# EAGLE design rimocon (EAGLE 9.6.2)
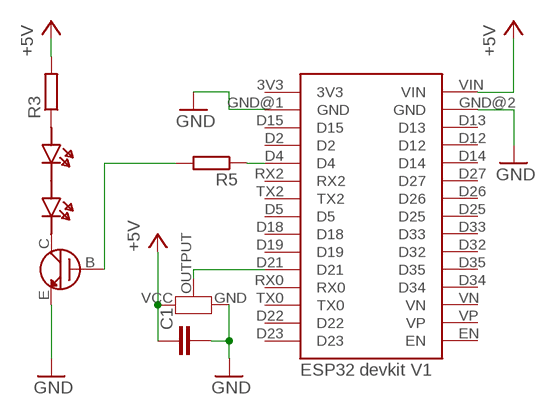
[diagram p0: schematic, sheet 1]

## Parts
C1  C-EU025-024X044  [C025-024X044]
R3  R-EU_0204/5  [0204/5]
R5  R-EU_0204/5  [0204/5]
U$1  2SC1815  [1815]
U$2  OSRB38C9AA  [OSRB38]
U$3  ESP32DEVKITV1  [ESP32DEVKITV1]
U$5  LEDOSI5FU3A11C  [OSI5FU3A11C]
U$6  LEDOSI5FU3A11C  [OSI5FU3A11C]

## Nets
+5V: C1.1 R3.2 U$2.VCC U$3.VIN
GND: C1.2 U$1.E U$2.GND U$3.GND@1(GND) U$3.GND@2(GND)
N$1: U$1.C U$5.K(CATHODE)
N$2: R3.1 U$6.A(ANODE)
N$3: R5.1 U$3.D4
N$4: U$2.OUTPUT U$3.D21
N$6: R5.2 U$1.B
N$8: U$5.A(ANODE) U$6.K(CATHODE)
Unconnected: U$3.D2 U$3.D5 U$3.D12 U$3.D13 U$3.D14 U$3.D15 U$3.D18 U$3.D19 U$3.D22 U$3.D23 U$3.D25 U$3.D26 U$3.D27 U$3.D32 U$3.D33 U$3.D34 U$3.D35 U$3.EN U$3.RX0 U$3.RX2 U$3.TX0 U$3.TX2 U$3.VN U$3.VP

## Power pins joined to a net without a drawn wire
3V3: U$3.3V3

## Library data of the parts
C1 = my_rcl:C-EU: CAPACITOR, European symbol
R3 R5 = my_rcl:R-EU_: RESISTOR, European symbol
U$1 = Custom_Parts:2SC1815
U$2 = Custom_Parts:OSRB38C9AA
U$3 = Custom_IC:ESP32DEVKITV1
U$5 U$6 = Custom_Parts:LED

## Board
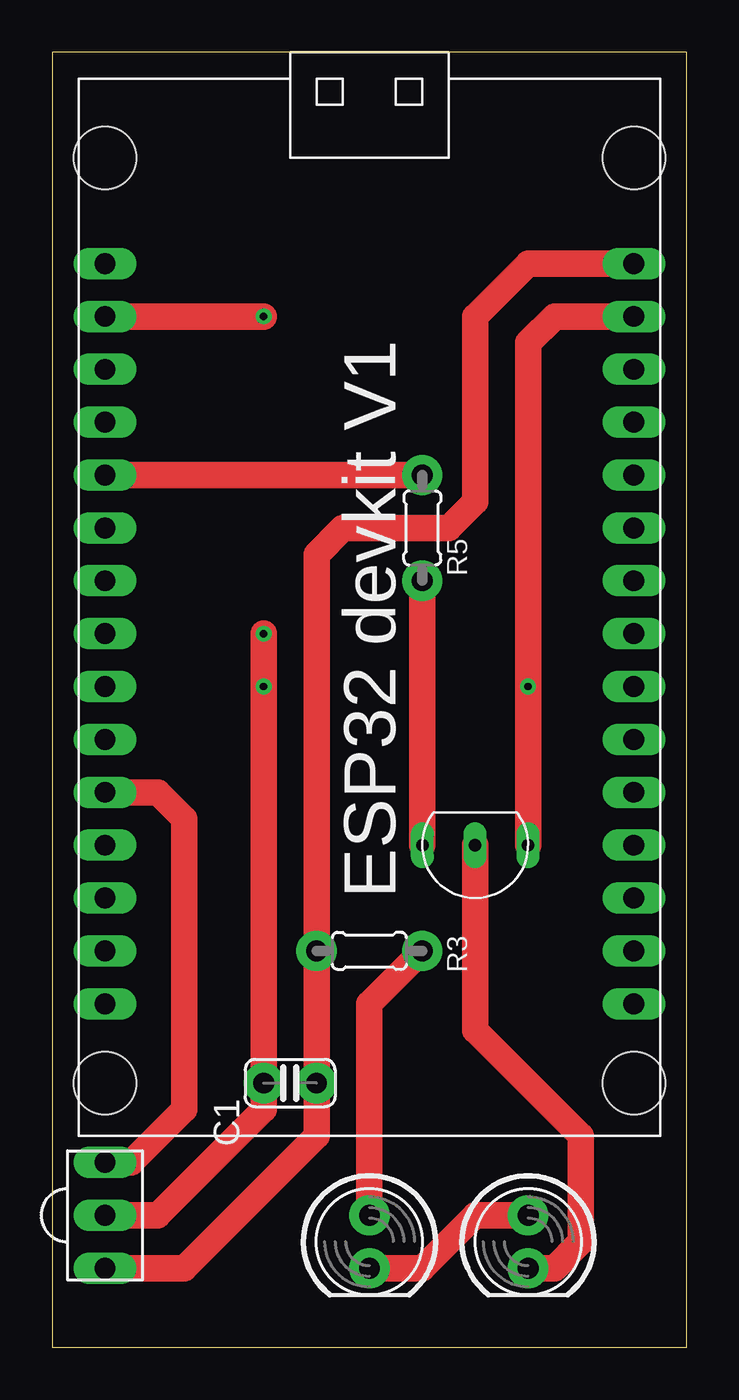
[diagram p1: board, top side]
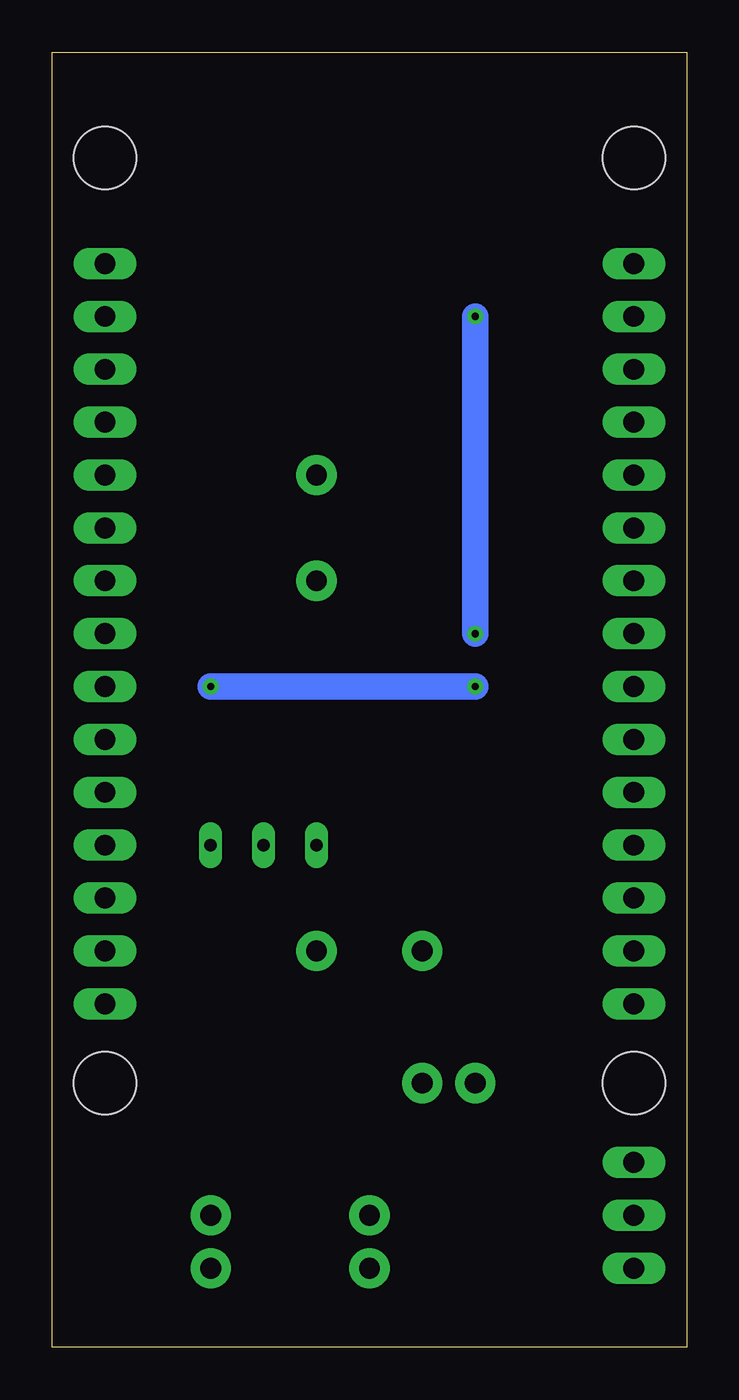
[diagram p2: board, bottom side, seen from below]

Size 30.48 x 62.23 mm. Coordinates in mm from the lower left corner, seen from the top.
Outline: 0,0 30.48,0 30.48,62.23 0,62.23 0,0
Copper layers (1*16): Top 0.035mm / dielectric 1.5mm / Bottom 0.035mm
Design rules "default": minimum track width 6mil, minimum drill 0.35mm, track to track 6mil, track to pad 6mil, pad to pad 6mil, via to via 6mil, smd to smd 6mil, copper to edge 40mil, drill to drill 6mil, minimum pad ring 10mil, minimum via ring 8mil, stop-mask expansion 4mil, vias tented up to drill 0mil, thermal gap 10mil
Holes 3 mm at 2.54,12.7 27.94,12.7 2.54,57.15 27.94,57.15

### Footprints (pad centres in the part's own frame; a part is rotated, then mirrored left to right if it is on the bottom)
C025-024X044 = drill 1 pad 1.93: 1 -1.27,0; 2 1.27,0
0204/5 = drill 1 pad 1.93: 1 -2.54,0; 2 2.54,0
1815 = drill 0.6 long: B -2.54,0; C 0,0; E 2.54,0
OSRB38 = drill 1 long: GND 0,0; OUTPUT 2.54,0; VCC -2.54,0
ESP32DEVKITV1 = drill 1 long: 3V3 -12.7,16.51; D2 -12.7,8.89; D4 -12.7,6.35; D5 -12.7,-1.27; D12 12.7,8.89; D13 12.7,11.43; D14 12.7,6.35; D15 -12.7,11.43; D18 -12.7,-3.81; D19 -12.7,-6.35; D21 -12.7,-8.89; D22 -12.7,-16.51; D23 -12.7,-19.05; D25 12.7,-1.27; D26 12.7,1.27; D27 12.7,3.81; D32 12.7,-6.35; D33 12.7,-3.81; D34 12.7,-11.43; D35 12.7,-8.89; EN 12.7,-19.05; GND@1 -12.7,13.97; GND@2 12.7,13.97; RX0 -12.7,-11.43; RX2 -12.7,3.81; TX0 -12.7,-13.97; TX2 -12.7,1.27; VIN 12.7,16.51; VN 12.7,-13.97; VP 12.7,-16.51
OSI5FU3A11C = drill 1 pad 1.93: A -1.27,0; K 1.27,0

### Placement (x,y rotation side)
C1  11.43,12.7 180 top
R3  15.24,19.05 180 top
R5  17.78,39.37 270 top
U$1  20.32,24.13 0 top
U$2  2.54,6.35 90 top
U$3  15.24,35.56 0 top
U$5  22.86,5.08 270 top
U$6  15.24,5.08 270 top

### Tracks (layer width: path | path; a pad name or v marks a point on that pad's centre or on a via)
+5V
  Top 1.27: U$3.VIN 22.86,52.07 20.32,49.53 20.32,40.64 19.05,39.37 13.97,39.37 12.7,38.1 R3.2 C1.1 12.7,10.16 6.35,3.81 U$2.VCC
GND  (via drill 0.35)
  Top 1.27: v10.16,49.53 U$3.GND@1 | U$2.GND 5.08,6.35 10.16,11.43 C1.2 v10.16,31.75 v10.16,34.29 | U$3.GND@2 24.13,49.53 22.86,48.26 v22.86,31.75 U$1.E
  Bottom 1.27: v10.16,49.53 v10.16,34.29 | v22.86,31.75 v10.16,31.75
N$1
  Top 1.27: U$1.C 20.32,15.24 25.4,10.16 25.4,5.08 24.13,3.81 U$5.K
N$2
  Top 1.27: U$6.A 15.24,16.51 R3.1
N$3
  Top 1.27: R5.1 U$3.D4
N$4
  Top 1.27: U$3.D21 5.08,26.67 6.35,25.4 6.35,11.43 3.81,8.89 U$2.OUTPUT
N$6
  Top 1.27: R5.2 U$1.B
N$8
  Top 1.27: U$5.A 20.32,6.35 17.78,3.81 U$6.K